# EAGLE design uSD_mux (EAGLE 6.5.0)
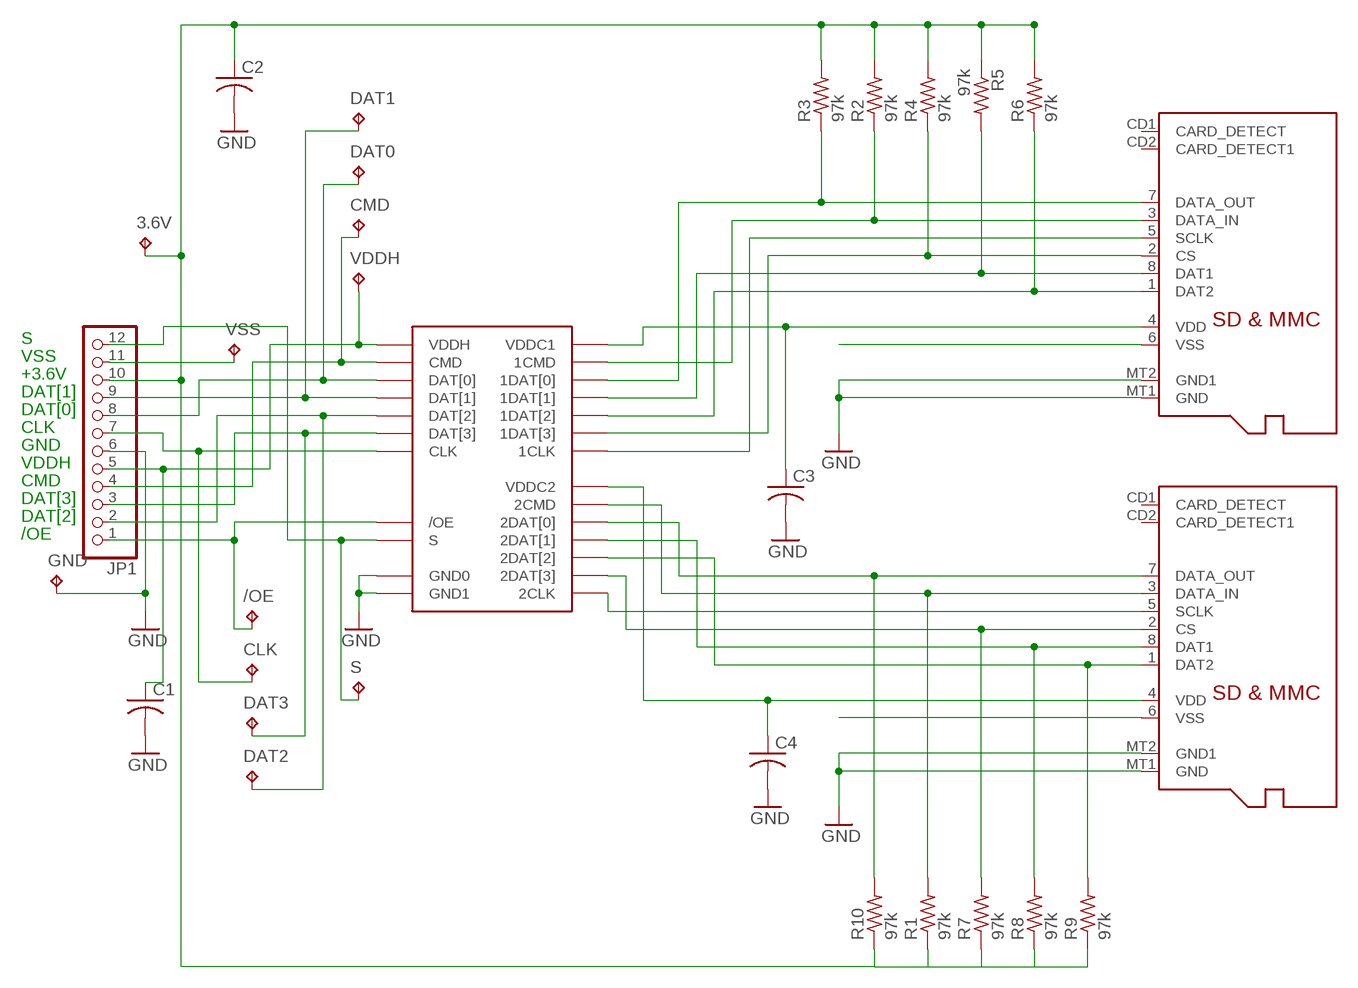
[diagram p0: schematic, sheet 1]

## Parts
3.6V  TPTP20R  [TP20R]
+3.6V  FSSD06  [MLP-24]
/OE  TPTP20R  [TP20R]
C1  C-USC0805  [C0805]
C2  C-USC0805  [C0805]
C3  C-USC0805  [C0805]
C4  C-USC0805  [C0805]
CLK  TPTP20R  [TP20R]
CMD  TPTP20R  [TP20R]
DAT0  TPTP20R  [TP20R]
DAT1  TPTP20R  [TP20R]
DAT2  TPTP20R  [TP20R]
DAT3  TPTP20R  [TP20R]
GND  TPTP20R  [TP20R]
JP1  PINHD-1X12  [1X12]
R1  97k  R-US_R0805  [R0805]
R2  97k  R-US_R0805  [R0805]
R3  97k  R-US_R0805  [R0805]
R4  97k  R-US_R0805  [R0805]
R5  97k  R-US_R0805  [R0805]
R6  97k  R-US_R0805  [R0805]
R7  97k  R-US_R0805  [R0805]
R8  97k  R-US_R0805  [R0805]
R9  97k  R-US_R0805  [R0805]
R10  97k  R-US_R0805  [R0805]
S  TPTP20R  [TP20R]
USD1  MICROSD  [MICROSD]
USD2  MICROSD  [MICROSD]
VDDH  TPTP20R  [TP20R]
VSS  TPTP20R  [TP20R]

## Nets
+3.6: 3.6V.TP C2.1 JP1.10 R1.1 R2.2 R3.2 R4.2 R5.1 R6.2 R7.1 R8.1 R9.1 R10.1
/OE: +3.6V./OE /OE.TP JP1.1
CLK: +3.6V.CLK CLK.TP JP1.7
CMD: +3.6V.CMD CMD.TP JP1.4
DAT0: +3.6V.DAT[0] DAT0.TP JP1.8
DAT1: +3.6V.DAT[1] DAT1.TP JP1.9
DAT2: +3.6V.DAT[2] DAT2.TP JP1.2
DAT3: +3.6V.DAT[3] DAT3.TP JP1.3
GND: +3.6V.GND0 +3.6V.GND1 C1.2 C2.2 C3.2 C4.2 GND.TP JP1.6 USD1.MT1(GND) USD1.MT2(GND1) USD2.MT1(GND) USD2.MT2(GND1)
N$1: +3.6V.1DAT[3] R4.1 USD1.2(CS)
N$3: +3.6V.1DAT[0] R3.1 USD1.7(DATA_OUT)
N$4: +3.6V.1DAT[1] R5.2 USD1.8(DAT1)
N$5: +3.6V.1DAT[2] R6.1 USD1.1(DAT2)
N$6: +3.6V.1CMD R2.1 USD1.3(DATA_IN)
N$7: +3.6V.1CLK USD1.5(SCLK)
N$8: +3.6V.2DAT[3] R7.2 USD2.2(CS)
N$9: +3.6V.2DAT[0] R10.2 USD2.7(DATA_OUT)
N$10: +3.6V.2DAT[1] R8.2 USD2.8(DAT1)
N$11: +3.6V.2DAT[2] R9.2 USD2.1(DAT2)
N$12: +3.6V.2CMD R1.2 USD2.3(DATA_IN)
N$13: +3.6V.2CLCK(2CLK) USD2.5(SCLK)
S: +3.6V.S JP1.12 S.TP
VDDC1: +3.6V.VDDC1 C3.1 USD1.4(VDD)
VDDC2: +3.6V.VDDC2 C4.1 USD2.4(VDD)
VDDH: +3.6V.VDDH C1.1 JP1.5 VDDH.TP
VSS: JP1.11 USD1.6(VSS) USD2.6(VSS) VSS.TP
Unconnected: USD1.CD1(CARD_DETECT) USD1.CD2(CARD_DETECT1) USD2.CD1(CARD_DETECT) USD2.CD2(CARD_DETECT1)

## Notes on the sheet
- S
- VSS
- +3.6V
- DAT[1]
- DAT[0]
- CLK
- GND
- VDDH
- CMD
- DAT[3]
- DAT[2]
- /OE

## Library data of the parts
3.6V /OE CLK CMD DAT0 DAT1-DAT3 GND S VDDH VSS = testpad:TP: Test pad
+3.6V = FSSD06_MLP24a:FSSD06
C1-C4 = rcl:C-US: CAPACITOR, American symbol
JP1 = adafruit:PINHD-1X12: PIN HEADER
R1-R10 = rcl:R-US_: RESISTOR, American symbol
USD1 USD2 = adafruit:MICROSD: Micro-SD / Transflash card holder with SPI pinout For the 3M # 2908-05WB-MG and/or 4UCON #19656 push-push type

## Board
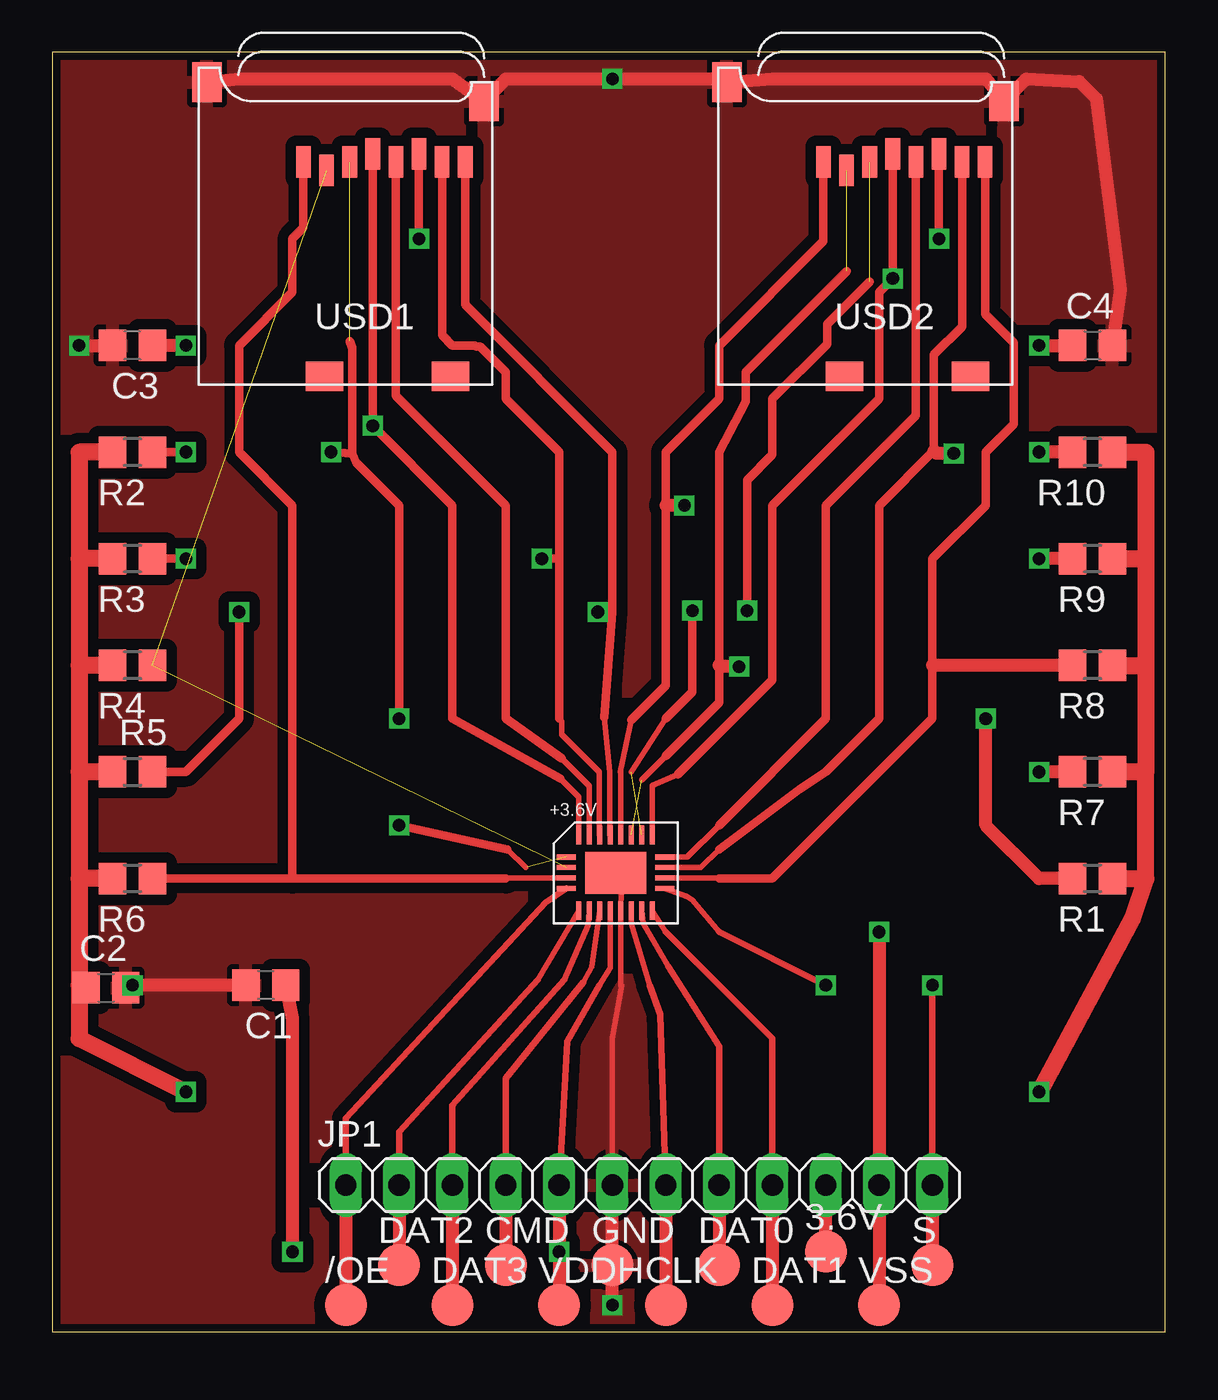
[diagram p1: board, top side]
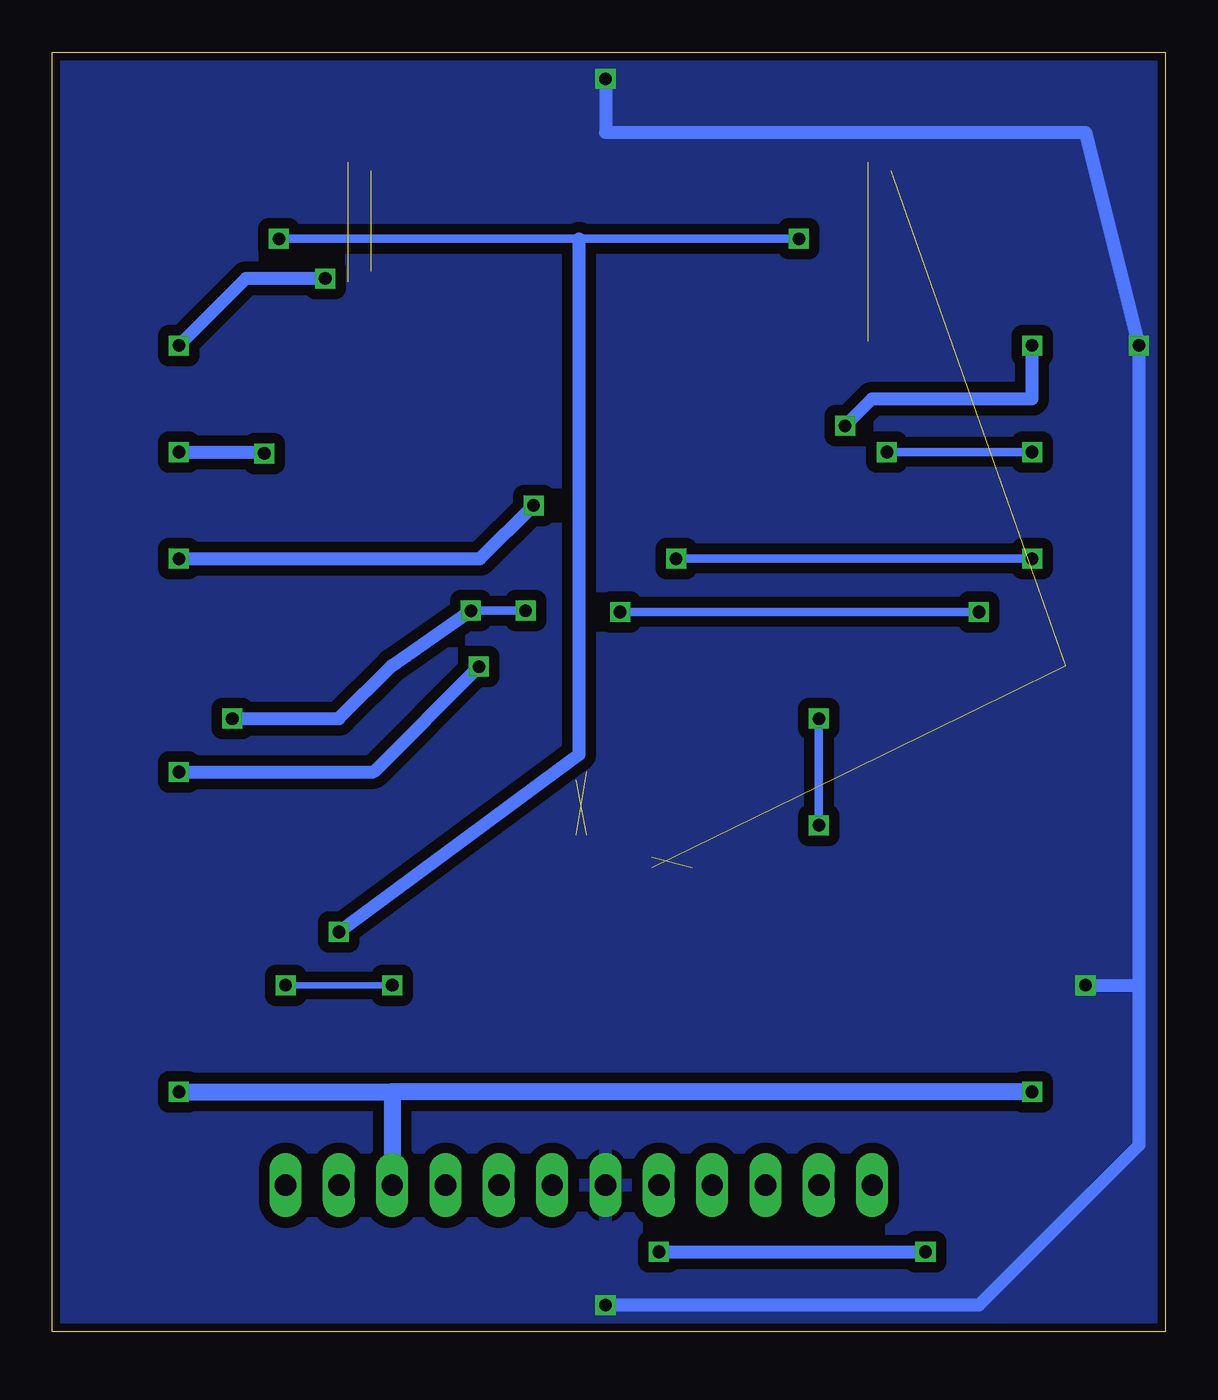
[diagram p2: board, bottom side, seen from below]

Size 53.01 x 60.95 mm. Coordinates in mm from the lower left corner, seen from the top.
Outline: 0,0 53.01,0 53.01,60.95 0,60.95 0,0
Copper layers (1*16): Top 0.0356mm / dielectric 1.5011mm / Bottom 0.0356mm
Design rules "LaenPCBOrder *": minimum track width 6mil, minimum drill 13mil, track to track 20mil, track to pad 20mil, pad to pad 20mil, via to via 20mil, smd to smd 20mil, copper to edge 15mil, drill to drill 6mil, minimum pad ring 7mil, minimum via ring 7mil, stop-mask expansion 3mil, vias tented up to drill 0mil, thermal gap 10mil

### Footprints (pad centres in the part's own frame; a part is rotated, then mirrored left to right if it is on the bottom)
TP20R = smd 2 x 2: TP 0,0
MLP-24 = smd 0.24 x 0.9: 1CLK -1.1,0.8; 1DAT[0] -0.6,0.8; 1DAT[1] -0.1,0.8; 2CMD 1.4,0.8; 2DAT[2] 0.4,0.8; 2DAT[3] 0.9,0.8; CLK 0.9,-2.8; CMD -0.6,-2.8; DAT[0] 1.4,-2.8; DAT[1] 1.9,-2.8; DAT[2] -1.6,-2.8; DAT[3] -1.1,-2.8; GND0 0.4,-2.8; VDDC1 -1.6,0.8; VDDC2 1.9,0.8; VDDH -0.1,-2.8 | smd 0.9 x 0.24: 1CMD -2.2,-0.25; 1DAT[2] -2.2,-1.25; 1DAT[3] -2.2,-0.75; 2CLCK 2.5,-0.25; 2DAT[0] 2.5,-0.75; 2DAT[1] 2.5,-1.25; /OE -2.2,-1.75; S 2.5,-1.75 | smd 2.9 x 2: GND1 0.15,-1
C0805 = smd 1.3 x 1.5: 1 -0.95,0; 2 0.95,0
1X12 = drill 1.016 long: 1 -13.97,0; 2 -11.43,0; 3 -8.89,0; 4 -6.35,0; 5 -3.81,0; 6 -1.27,0; 7 1.27,0; 8 3.81,0; 9 6.35,0; 10 8.89,0; 11 11.43,0; 12 13.97,0
R0805 = smd 1.3 x 1.5: 1 -0.95,0; 2 0.95,0
MICROSD = smd 0.7 x 1.5: 1 9,-10.64; 2 7.9,-10.24; 3 6.8,-10.64; 4 5.7,-11.04; 5 4.6,-10.64; 6 3.5,-11.04; 7 2.4,-10.64; 8 1.3,-10.64 | smd 1.8 x 1.4: CD1 2,-0.44; CD2 8,-0.44 | smd 1.4 x 1.9: MT1 0.4,-13.54; MT2 13.6,-14.44

### Placement (x,y rotation side)
3.6V  36.83,3.81 0 top
+3.6V  26.67,22.86 0 top
/OE  13.97,1.27 0 top
C1  10.16,16.51 180 top
C2  2.54,16.38 0 top
C3  3.81,46.99 180 top
C4  49.53,46.99 0 top
CLK  29.21,1.27 0 top
CMD  21.59,3.17 0 top
DAT0  31.75,3.17 0 top
DAT1  34.29,1.27 0 top
DAT2  16.51,3.17 0 top
DAT3  19.05,1.27 0 top
GND  26.67,3.17 0 top
JP1  27.94,6.99 0 top
R1  49.53,21.59 180 top
R2  3.81,41.91 180 top
R3  3.81,36.83 180 top
R4  3.81,31.75 180 top
R5  3.81,26.67 0 top
R6  3.81,21.59 180 top
R7  49.53,26.67 180 top
R8  49.53,31.75 180 top
R9  49.53,36.83 180 top
R10  49.53,41.91 180 top
S  41.91,3.17 0 top
USD1  20.95,45.09 180 top
USD2  45.72,45.09 180 top
VDDH  24.13,1.27 0 top
VSS  39.37,1.27 0 top

### Tracks (layer width: path | path; a pad name or v marks a point on that pad's centre or on a via)
+3.6  (via drill 0.6)
  Top 0.61: 3.6V.TP JP1.10 | 1.27,16.51 C2.1
  Top 0.813: R2.2 1.27,41.91 1.27,36.83 | R3.2 1.27,36.83 | 1.27,36.83 1.27,31.75 | R4.2 1.27,31.75 | 1.27,31.75 1.27,26.67 | R5.1 1.27,26.67 | 1.27,26.67 1.27,21.59 | R6.2 1.27,21.59 | 1.27,21.59 1.27,16.51 1.27,13.97 v6.35,11.43 | R10.1 52.07,41.91 52.07,36.83 | R9.1 52.07,36.83 | 52.07,36.83 52.07,31.75 | R8.1 52.07,31.75 | 52.07,31.75 52.07,26.67 | 52.07,26.67 R7.1 | 52.07,21.59 52.07,26.67 | R1.1 52.07,21.59 | 52.07,21.59 51.44,19.68 v46.99,11.43
  Bottom 0.813: v6.35,11.43 36.83,11.43 | 36.83,11.43 JP1.10 | v46.99,11.43 36.83,11.43
/OE
  Top 0.305: +3.6V./OE 23.5,20.45 13.97,10.16 JP1.1
  Top 0.61: JP1.1 /OE.TP
CLK
  Top 0.254: 28.45,16.51 27.57,19.46 +3.6V.CLK
  Top 0.305: 28.45,16.51 28.96,15.11 JP1.7
  Top 0.61: JP1.7 CLK.TP
CMD
  Top 0.254: 25.27,16.64 25.69,17.38 +3.6V.CMD
  Top 0.305: 25.27,16.64 21.59,12.06 JP1.4
  Top 0.61: JP1.4 CMD.TP
DAT0
  Top 0.254: 29.34,17.4 28.13,19.46 +3.6V.DAT[0]
  Top 0.305: 29.34,17.4 31.75,13.59 JP1.8
  Top 0.61: JP1.8 DAT0.TP
DAT1
  Top 0.254: 29.21,19.05 +3.6V.DAT[1]
  Top 0.305: 29.21,19.05 34.29,13.97 JP1.9
  Top 0.61: JP1.9 DAT1.TP
DAT2
  Top 0.254: 23.11,16.76 +3.6V.DAT[2]
  Top 0.305: 23.11,16.76 16.51,9.53 JP1.2
  Top 0.61: JP1.2 DAT2.TP
DAT3
  Top 0.254: 24.38,16.76 25.52,19.38 +3.6V.DAT[3]
  Top 0.305: 24.38,16.76 19.05,10.79 JP1.3
  Top 0.61: JP1.3 DAT3.TP
GND  (via drill 0.6)
  Top 0.254: +3.6V.GND1 27.09,21.05 +3.6V.GND0 27.07,16.51 27.11,16.51 26.67,13.97 JP1.6
  Top 0.61: USD1.MT2 8.89,59.69 19.05,59.69 USD1.MT1 21.59,59.69 v26.67,59.69 31.75,59.69 USD2.MT2 34.29,59.69 44.45,59.69 USD2.MT1 46.38,59.69 48.9,59.56 49.72,58.74 50.86,49.66 C4.2 | GND.TP v26.67,1.27 JP1.6 | C2.2 v3.81,16.51 C1.2 | v1.27,46.99 C3.2
  Bottom 0.61: v26.67,59.69 26.67,57.15 3.81,57.15 v1.27,46.99 1.27,16.51 | 1.27,16.51 1.27,8.89 8.89,1.27 v26.67,1.27 | v3.81,16.51 1.27,16.51
  pour Top: 0,60.96 52.7,60.96 52.7,0 0,0
  pour Bottom: 0,60.96 52.7,60.96 52.7,0 0,0
  pour Top: 53.34,0 53.34,55.88 5.08,55.88 5.08,0
N$1  (2 unrouted)
N$3  (via drill 0.6)
  Top 0.254: +3.6V.1DAT[0] 26.04,23.66 26.04,26.67 24.26,28.45 24.26,29.08 24.13,29.21
  Top 0.406: USD1.7 18.55,47.48 19.05,46.99 20.13,46.99 20.19,46.93 20.38,46.93 21.59,45.72 21.59,44.45 24.13,41.91 24.13,36.83 | 24.13,36.83 24.13,29.21 | R3.1 v6.35,36.83 | v23.3,36.83 24.13,36.83
  Bottom 0.406: v6.35,36.83 v23.3,36.83
N$4  (via drill 0.6)
  Top 0.254: +3.6V.1DAT[1] 26.54,23.66 26.54,26.67 26.29,29.27
  Top 0.406: USD1.8 19.66,48.92 26.67,41.91 26.67,34.29 | 26.67,34.29 26.29,29.27 | R5.2 6.35,26.67 8.89,29.21 v8.89,34.29 | v25.97,34.29 26.67,34.29
  Bottom 0.406: v8.89,34.29 v25.97,34.29
N$5
  Top 0.254: +3.6V.1DAT[2] 21.61,21.61 21.59,21.59
  Top 0.406: USD1.1 11.96,52.59 11.43,52.07 11.43,49.53 8.89,46.99 8.89,41.91 11.43,39.37 11.43,21.59 | 21.59,21.59 11.43,21.59 | 11.43,21.59 R6.1
N$6  (via drill 0.6)  (2 unrouted)
  Top 0.254: 22.53,22.11 21.65,22.99
  Top 0.406: 14.15,47.19 14.29,46.86 14.29,41.85 | 14.29,41.85 14.48,41.4 16.51,39.37 v16.51,29.21 | R2.1 v6.35,41.91 | v13.27,41.91 14.29,41.85 | v16.51,24.13 21.65,22.99
  Bottom 0.406: v6.35,41.91 v13.27,41.91 | v16.51,29.21 v16.51,24.13
N$7
  Top 0.254: +3.6V.1CLK 25.57,25.99 24.26,27.3
  Top 0.406: USD1.5 16.36,44.6 21.59,39.37 21.59,29.21 24.26,27.3
N$8  (via drill 0.6)  (2 unrouted)
  Top 0.254: 28.07,26.29 29.21,27.43
  Top 0.406: 37.82,50.52 33.02,45.72 33.02,44.32 31.75,41.91 31.75,31.75 31.75,29.97 29.21,27.43
  Top 0.61: R7.2 v46.99,26.67 | v32.7,31.69 31.81,31.69 31.75,31.75
  Bottom 0.61: v46.99,26.67 37.72,26.67 v32.7,31.69
N$9  (via drill 0.6)
  Top 0.254: +3.6V.2DAT[0] 30.87,22.11 31.75,22.99
  Top 0.406: USD2.7 43.32,47.89 41.97,46.55 41.97,41.97 39.37,39.37 39.37,29.21 36.83,26.67 35.56,25.84 31.75,22.99
  Top 0.61: R10.2 v46.99,41.91 | v42.93,41.85 42.1,41.85 41.97,41.97
  Bottom 0.61: v46.99,41.91 42.99,41.91 v42.93,41.85
N$10
  Top 0.254: +3.6V.2DAT[1] 31.73,21.61 31.75,21.59
  Top 0.406: USD2.8 44.42,48.48 45.78,47.12 45.78,43.24 44.45,41.91 44.45,39.37 41.91,36.83 41.91,31.75 41.91,29.21 34.29,21.59 31.75,21.59
  Top 0.61: R8.2 41.91,31.75
N$11  (via drill 0.6)
  Top 0.254: +3.6V.2DAT[2] 27.07,26.67 27.05,26.67 27.56,29.15
  Top 0.406: USD2.1 36.72,51.96 31.75,46.99 31.75,44.45 29.21,41.91 29.21,39.37 29.21,30.8 27.56,29.15
  Top 0.61: R9.2 v46.99,36.83 | v30.1,39.37 29.21,39.37
  Bottom 0.61: v46.99,36.83 32.64,36.83 v30.1,39.37
N$12  (via drill 0.6)  (2 unrouted)
  Top 0.254: 29.21,29.21 27.56,26.67
  Top 0.406: 38.92,50.03 36.89,48.01 36.89,47.05 34.29,44.45 34.29,41.78 33.08,40.58 v33.08,34.35 | v30.48,34.35 30.48,30.48 29.21,29.21
  Top 0.61: R1.2 46.99,21.59 44.45,24.13 v44.45,29.21
  Bottom 0.406: v33.08,34.35 v30.48,34.35
  Bottom 0.61: v44.45,29.21 39.37,29.21 36.83,31.75 v33.08,34.35
N$13
  Top 0.254: +3.6V.2CLCK 30.23,22.61 31.75,24.13
  Top 0.406: USD2.5 41.12,43.66 36.83,39.37 36.83,29.21 31.75,24.13
S  (via drill 0.6)
  Top 0.254: +3.6V.S 30.2,20.73 30.48,20.57 31.75,19.05
  Top 0.305: 31.75,19.05 v36.83,16.51 | v41.91,16.51 JP1.12
  Top 0.61: JP1.12 S.TP
  Bottom 0.305: v36.83,16.51 v41.91,16.51
VDDC1  (via drill 0.6)
  Top 0.254: +3.6V.VDDC1 25.07,25.48 24.19,26.35
  Top 0.406: USD1.4 v15.26,43.16 19.05,39.37 19.05,29.21 24.19,26.35
  Top 0.61: v6.35,46.99 C3.1
  Bottom 0.61: v15.26,43.16 13.97,44.45 6.35,44.45 v6.35,46.99
VDDC2  (via drill 0.6)
  Top 0.254: +3.6V.VDDC2 28.57,26.03 29.78,26.54
  Top 0.406: USD2.4 v40.02,50.18 39.37,49.53 39.37,44.45 34.29,39.37 34.29,31.05 29.78,26.54
  Top 0.61: v46.99,46.99 C4.1
  Bottom 0.61: v40.02,50.18 43.8,50.18 v46.99,46.99
VDDH  (via drill 0.6)
  Top 0.254: 26.04,16.51 26.57,17.34 +3.6V.VDDH
  Top 0.305: 26.04,16.51 24.51,13.84 JP1.5
  Top 0.61: C1.1 11.43,14.92 v11.43,3.81 | VDDH.TP v24.13,3.81 JP1.5
  Bottom 0.61: v24.13,3.81 v11.43,3.81
VSS  (via drill 0.6)
  Top 0.406: USD1.6 v17.45,52.08 v17.46,52.07 | USD2.6 v42.22,52.07 v42.23,52.07
  Top 0.61: VSS.TP JP1.11 v39.37,19.05
  Bottom 0.406: v17.46,52.07 27.94,52.07 v42.23,52.07
  Bottom 0.61: 27.94,52.07 27.94,27.5 v39.37,19.05